# Altium schematic sheet EEPROM.SchDoc
size A4; Organization: Altium Limited; Address1: L3, 12a Rodborough Rd; Address2: Frenchs Forest; Address3: NSW; Address4: Australia 2086
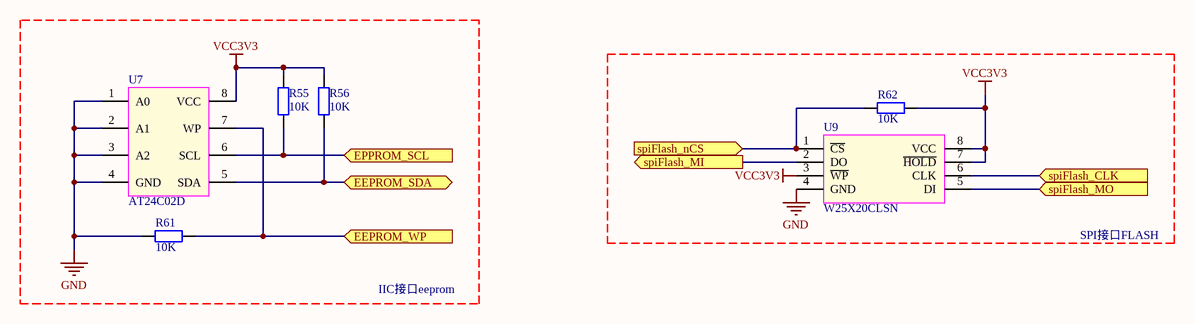
[diagram p0: EEPROM.SchDoc]

## Parts
R55  10K  [R0603]
R56  10K  [R0603]
R61  10K  [R0603]
R62  10K  [R0603]
U7  AT24C02D  [SOP8]
U9  W25X20CLSN  [SOP8]

## Ports
EEPROM_SDA (bidir), EEPROM_WP (in), EPPROM_SCL (in), spiFlash_CLK (in), spiFlash_MI (out), spiFlash_MO (in), spiFlash_nCS (in)

## Nets
GND: R61.1 U7.1(A0) U7.2(A1) U7.3(A2) U7.4(GND) U9.4(GND)
VCC3V3: R55.1 R56.1 R62.2 U7.8(VCC) U9.3(~{WP}) U9.7(~{HOLD}) U9.8(VCC)
EEPROM_SDA: R56.2 U7.5(SDA) ; port EEPROM_SDA
EEPROM_WP: R61.2 U7.7(WP) ; port EEPROM_WP
EPPROM_SCL: R55.2 U7.6(SCL) ; port EPPROM_SCL
spiFlash_CLK: U9.6(CLK) ; port spiFlash_CLK
spiFlash_MI: U9.2(DO) ; port spiFlash_MI
spiFlash_MO: U9.5(DI) ; port spiFlash_MO
spiFlash_nCS: R62.1 U9.1(~{CS}) ; port spiFlash_nCS

## Notes on the sheet
- IIC接口eeprom
- SPI接口FLASH
- Title
- Size:
- Date:
- A4
- Number:
- Time:
- Revision:
- Sheet
- of
- File:

## Library data of the parts
R55 R56 R61 R62 = RES_06
U7 = AT24C02D: EEPROM
U9 = W25X20CLSN: 2M-bit/256K Byte(262,144)